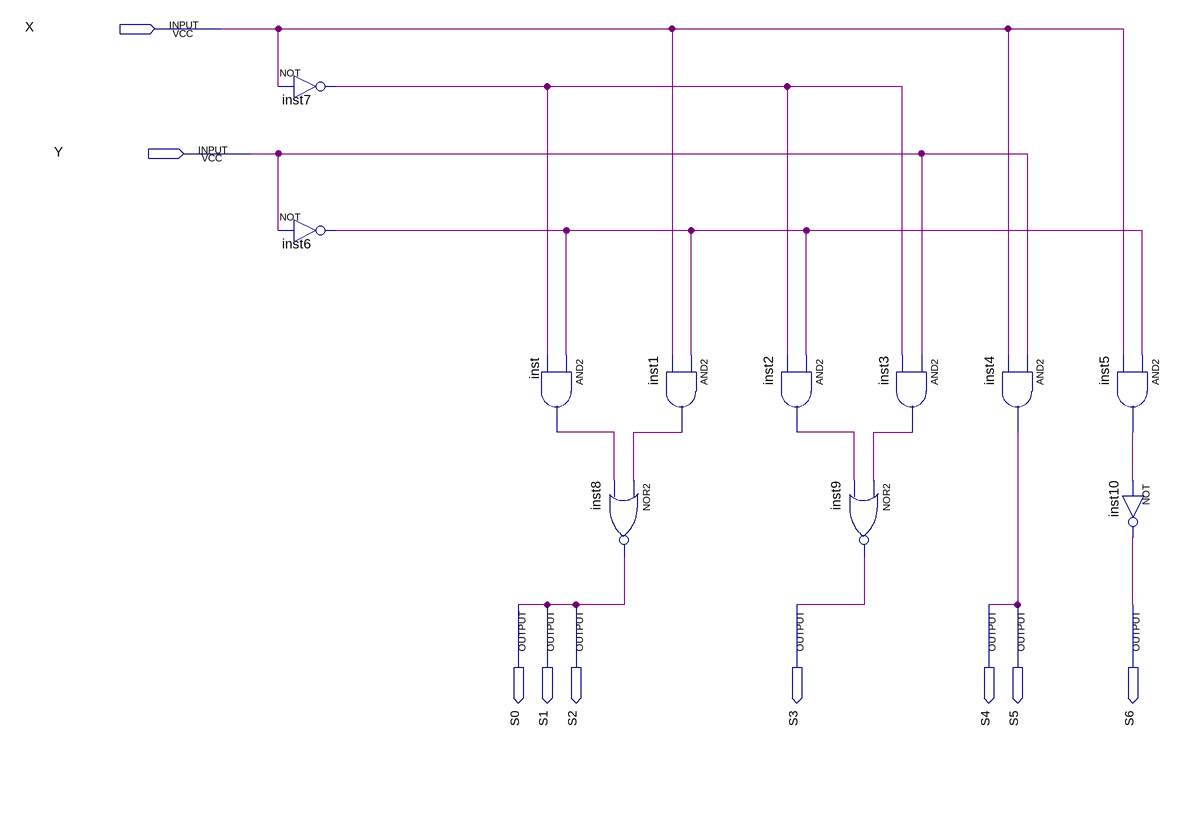
[diagram p0: schematic sheet]
// Quartus schematic circuito_base.bdf as structural Verilog: 11 symbols, 9 pins
module circuito_base (
  input  X,
  input  Y,
  output S0,
  output S1,
  output S2,
  output S3,
  output S4,
  output S5,
  output S6
);

  wire inst1_out, inst2_out, inst3_out, inst5_out, inst6_out, inst7_out, inst_out;

  not inst7 (inst7_out, X);
  not inst6 (inst6_out, Y);
  and inst (inst_out, inst6_out, inst7_out);
  nor inst8 (S0, inst1_out, inst_out);
  and inst1 (inst1_out, inst6_out, X);
  and inst2 (inst2_out, inst6_out, inst7_out);
  nor inst9 (S3, inst3_out, inst2_out);
  and inst3 (inst3_out, Y, inst7_out);
  and inst4 (S4, Y, X);
  and inst5 (inst5_out, inst6_out, X);
  not inst10 (S6, inst5_out);

  assign S1 = S0;
  assign S2 = S0;
  assign S5 = S4;
endmodule
